# EAGLE schematic rimocon (EAGLE 9.6.2)
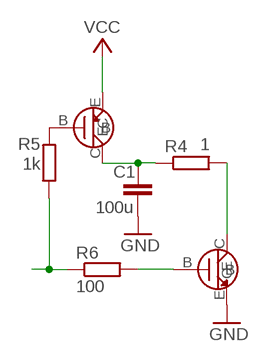
[diagram p0: schematic, sheet 1]

## Parts
C1  100u  C-EU025-025X050  [C025-025X050]
R4  1  R-EU_0204/5  [0204/5]
R5  1k  R-EU_0204/5  [0204/5]
R6  100  R-EU_0204/5  [0204/5]
U$1  2SC1815  [1815]
U$2  2SA1815  [1815]

## Nets
GND: C1.2 U$1.E
N$1: R5.2 U$2.B
N$2: C1.1 R4.1 U$2.C
N$3: R6.2 U$1.B
N$4: R5.1 R6.1
N$5: R4.2 U$1.C
VCC: U$2.E

## Library data of the parts
C1 = rcl:C-EU: CAPACITOR, European symbol; SPICEPREFIX: C
R4-R6 = my_rcl:R-EU_: RESISTOR, European symbol
U$1 = Custom_Parts:2SC1815
U$2 = Custom_Parts:2SA1815